# Altium schematic sheet eDP.SchDoc: DARKYDEN_eDP
size Letter; ApprovedBy: APPROUVÉ PAR; Author: Harold Malbrouck; Organization: Cegep Limoilou; Address1: 1300, 8e Avenue; Address2: Québec, QC; Address3: Canada; Address4: G1J 5L5; Revision: Rev.A; SheetNumber: 15; SheetTotal: 22
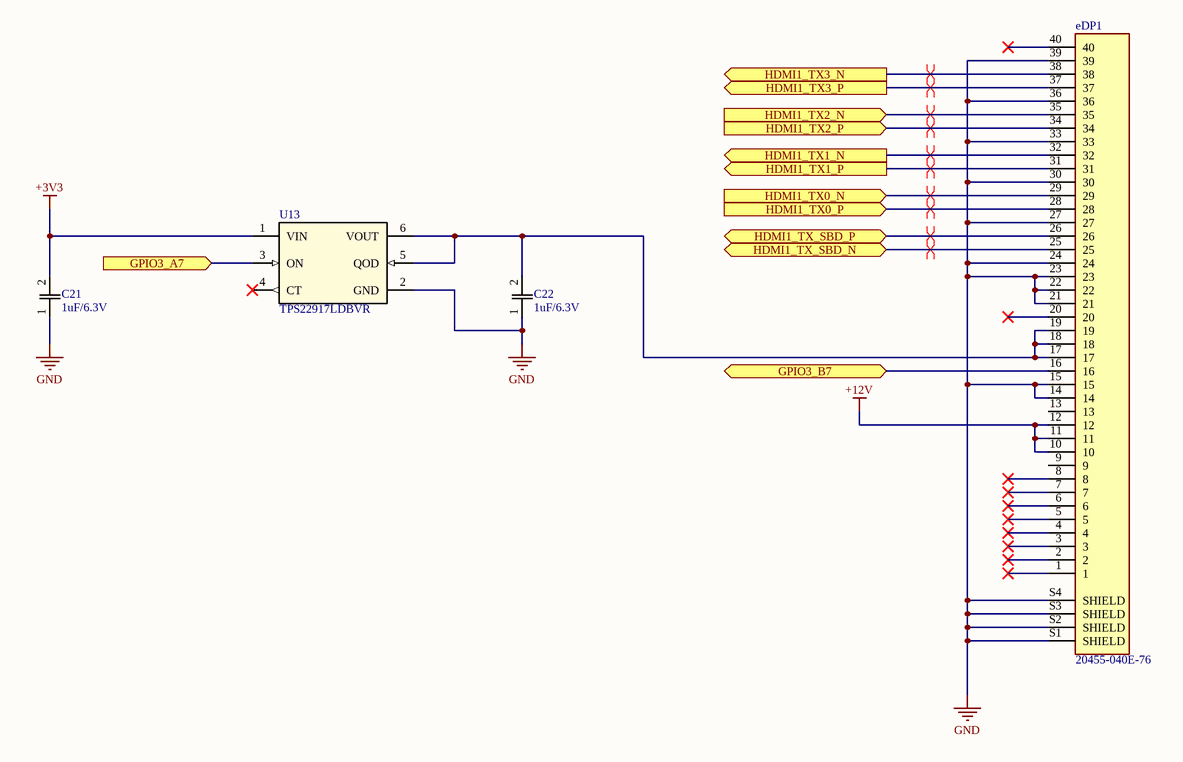
[diagram p0: eDP.SchDoc]

## Parts
C21  1uF/6.3V  [C0805]
C22  1uF/6.3V  [C0805]
eDP1  20455-040E-76  [IPEX_20455-040E-76]
U13  TPS22917LDBVR  [DBV0006_L]

## Ports
GPIO3_A7 (in, see CONNECTEUR_4[3C]), GPIO3_B7 (bidir, see CONNECTEUR_4[3C]), HDMI1_TX0_N (in, see CONNECTEUR_4[1A]), HDMI1_TX0_P (in, see CONNECTEUR_4[1A]), HDMI1_TX1_N (out, see CONNECTEUR_4[1A]), HDMI1_TX1_P (out, see CONNECTEUR_4[1A]), HDMI1_TX2_N (in, see CONNECTEUR_4[1A]), HDMI1_TX2_P (in, see CONNECTEUR_4[1A]), HDMI1_TX3_N (out, see CONNECTEUR_4[1A]), HDMI1_TX3_P (out, see CONNECTEUR_4[1A]), HDMI1_TX_SBD_N (bidir, see CONNECTEUR_4[1B]), HDMI1_TX_SBD_P (bidir, see CONNECTEUR_4[1B])

## Nets
+3V3: C21.2 U13.1(VIN)
+12V: eDP1.10 eDP1.11 eDP1.12
GND: C21.1 C22.1 eDP1.14 eDP1.15 eDP1.21 eDP1.22 eDP1.23 eDP1.24 eDP1.27 eDP1.30 eDP1.33 eDP1.36 eDP1.39 eDP1.S1(SHIELD) eDP1.S2(SHIELD) eDP1.S3(SHIELD) eDP1.S4(SHIELD) U13.2(GND)
GPIO3_A7: U13.3(ON) ; port GPIO3_A7
GPIO3_B7: eDP1.16 ; port GPIO3_B7
HDMI1_TX0_N: eDP1.29 ; port HDMI1_TX0_N
HDMI1_TX0_P: eDP1.28 ; port HDMI1_TX0_P
HDMI1_TX1_N: eDP1.32 ; port HDMI1_TX1_N
HDMI1_TX1_P: eDP1.31 ; port HDMI1_TX1_P
HDMI1_TX2_N: eDP1.35 ; port HDMI1_TX2_N
HDMI1_TX2_P: eDP1.34 ; port HDMI1_TX2_P
HDMI1_TX3_N: eDP1.38 ; port HDMI1_TX3_N
HDMI1_TX3_P: eDP1.37 ; port HDMI1_TX3_P
HDMI1_TX_SBD_N: eDP1.25 ; port HDMI1_TX_SBD_N
HDMI1_TX_SBD_P: eDP1.26 ; port HDMI1_TX_SBD_P
NetC22_2: C22.2 eDP1.17 eDP1.18 eDP1.19 U13.5(QOD) U13.6(VOUT)

Not connected (* = marked no-connect by the designer): eDP1 1* 2* 3* 4* 5* 6* 7* 8* 9 13 20* 40*; U13 4(CT)*

## Layout directives
differential pair: HDMI1_TX0_N, HDMI1_TX0_P, HDMI1_TX1_N, HDMI1_TX1_P, HDMI1_TX2_N, HDMI1_TX2_P, HDMI1_TX3_N, HDMI1_TX3_P, HDMI1_TX_SBD_N, HDMI1_TX_SBD_P

## Notes on the sheet
- Titre :
- Conception :
- Date :
- Approbation :
- Heure :
- Révision :
- Feuille
- de
- Fichier :

## Library data of the parts
C21 C22 = C0805C105K9RACTU: 1 uF, 6.3 V, ± 10%, X7R, 0805 [2012 Metric] Multilayer Ceramic Capacitor,; Manufacturer_Name: KEMET; Value: 1uF; Voltage Rating: 6.3V; Datasheet Link: https://content.kemet.com/datasheets/KEM_C1002_X7R_SMD.pdf; Height: 1.1mm; Manufacturer_Part_Number: C0805C105K9RACTU; Mouser Part Number: 80-C0805C105K9R; Mouser Price/Stock: https://www.mouser.co.uk/ProductDetail/KEMET/C0805C105K9RACTU?qs=Nnkldhwoc36daYb4WU%2Fecw%3D%3D; Arrow Part Number: C0805C105K9RACTU; Arrow Price/Stock: https://www.arrow.com/en/products/c0805c105k9ractu/kemet-corporation?utm_currency=USD&region=nac; Supplier: Digikey; Supplier Part Number: 399-13161-1-ND; Manufacturer: KEMET; Manufacturer Part Number: C0805C105K9RACTU; RoHS: Yes; Category: Ceramic Capacitors; Stock: 8847; Pricing: 1=0.49, 10=0.397, 100=0.3017, 1000=0.24335, 2500=0.22102, 5000=0.20619, 7500=0.16784, 12500=0.12939, 17500=0.02492, 25000=0.02414, 62500=0.02244, 125000=0.02142, 250000=0.02059 (USD); Mounting Technology: Surface Mount; Case/Package: 0805; Case Code (Metric): 2012; Case Code (Imperial): 0805; Dielectric Material: Ceramic; Min Operating Temperature: -55°C; Max Operating Temperature: 125°C; Packaging: Tape and Reel; Tolerance: 10%; Package Quantity: 4000; Voltage Rating (DC): 6.3V; Dielectric: X7R; Termination: SMD/SMT; Series: C0805C; Construction: Flat; Length: 2mm; Width: 1.2mm; Thickness: 0.039inch; Lead Pitch: 0.75mm; Depth: 1.25mm; Radiation Hardening: No; RoHS Compliant: Yes; ComponentLink1URL: https://datasheet.ciiva.com/5416/kem-c1002-x7r-smd-5416463.pdf?src-supplier=Mouser; ComponentLink1Description: https://datasheet.ciiva.com/5416/kem-c1002-x7r-smd-5416463.pdf?src-supplier=Mouser
eDP1 = 20455-040E-76: Conn Wire to Board RCP 40 POS 0.5mm Solder RA Side Entry SMDCABLINE® T/R; Manufacturer: I-PEX; Package: None; Price: None; Value: *; MP: 20455-040E-76; Availability: Unavailable; Supplier: Digikey; Supplier Part Number: 5378-20455-040E-76CT-ND; Manufacturer Part Number: 20455-040E-76; RoHS: No; Category: FFC / FPC; Stock: 7447; Pricing: 1=2.21, 10=1.878, 25=1.7604, 50=1.6764, 100=1.5962, 250=1.49624, 500=1.4248, 1000=1.377 (USD); RoHS Compliant: No; ComponentLink1URL: https://datasheet.octopart.com/20455-040E-76-I-PEX-datasheet-154856138.pdf?src-supplier=Future+Electronics; ComponentLink1Description: https://datasheet.octopart.com/20455-040E-76-I-PEX-datasheet-154856138.pdf?src-supplier=Future+Electronics; ComponentLink2URL: http://datasheet.octopart.com/20455-040E-76-I-PEX-datasheet-154856138.pdf?src-supplier=Quest; ComponentLink2Description: http://datasheet.octopart.com/20455-040E-76-I-PEX-datasheet-154856138.pdf?src-supplier=Quest
U13 = TPS22917LDBVR: 5.5-V, 2-A, 80-mΩ , 10-nA leakage load switch adj. rise time and adj output discharge 6-SOT-23 -45 to 125; Mfr_Name: Texas Instruments; TYPE: TYPE; RefDes: RefDes; Supplier: Digikey; Supplier Part Number: 296-TPS22917LDBVRCT-ND; Manufacturer: Texas Instruments; Manufacturer Part Number: TPS22917LDBVR; RoHS: No; Category: Integrated Circuits (ICs); Stock: 10229; Pricing: 1=0.41, 10=0.284, 25=0.2528, 100=0.2188, 250=0.20248, 500=0.1927, 1000=0.18463 (USD); Case/Package: 926Case; Pins: 6NUMBER; Length: 2.9mm; Width: 1.6mm; Thickness: 1.2mm